# Altium project TrackCommenderCar_ControlBlock.PrjPcb
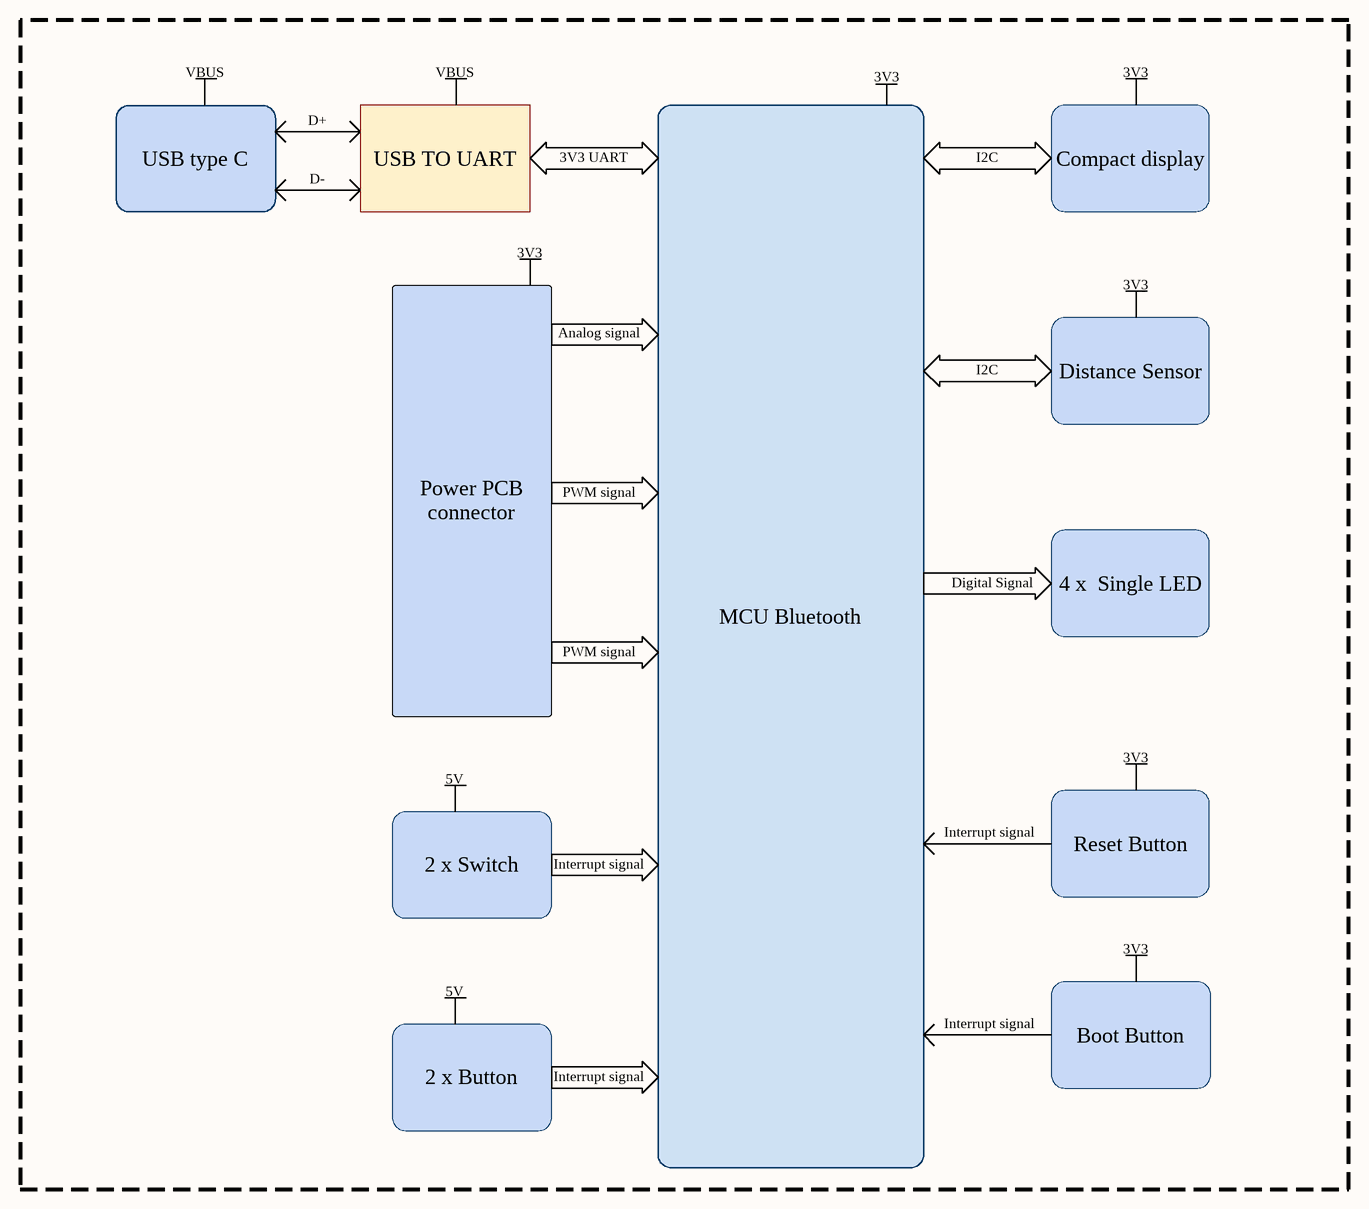
[diagram p0: OverView_TrackCommenderCar_FunctionPart.SchDoc]
3 sheets, 108 parts. Net scope: flat (ports and power ports of the same name join across sheets).
Board file: TrackCommanderCar.PcbDoc
Sheets:
  OverView_TrackCommenderCar_FunctionPart.SchDoc
  Sch_TrackCommanderCar_PowerPart.SchDoc
  Sch_TrackCommenderCar_FunctionPart.SchDoc

## Sheet OverView_TrackCommenderCar_FunctionPart.SchDoc
size 420 x 297 mm; SheetNumber: 1; SheetTotal: 2

### Notes on the sheet
- VBUS
- 3V3
- D+
- USB type C
- D-
- USB TO UART
- 3V3 UART
- I2C
- Compact display
- Analog signal
- Distance Sensor
- Power PCB connector
- PWM signal
- Digital Signal
- 4 x  Single LED
- MCU Bluetooth
- 5V
- 2 x Switch
- Interrupt signal
- Reset Button
- 2 x Button
- Boot Button

## Sheet Sch_TrackCommanderCar_PowerPart.SchDoc
size 457 x 254 mm; SheetNumber: 2; SheetTotal: 3
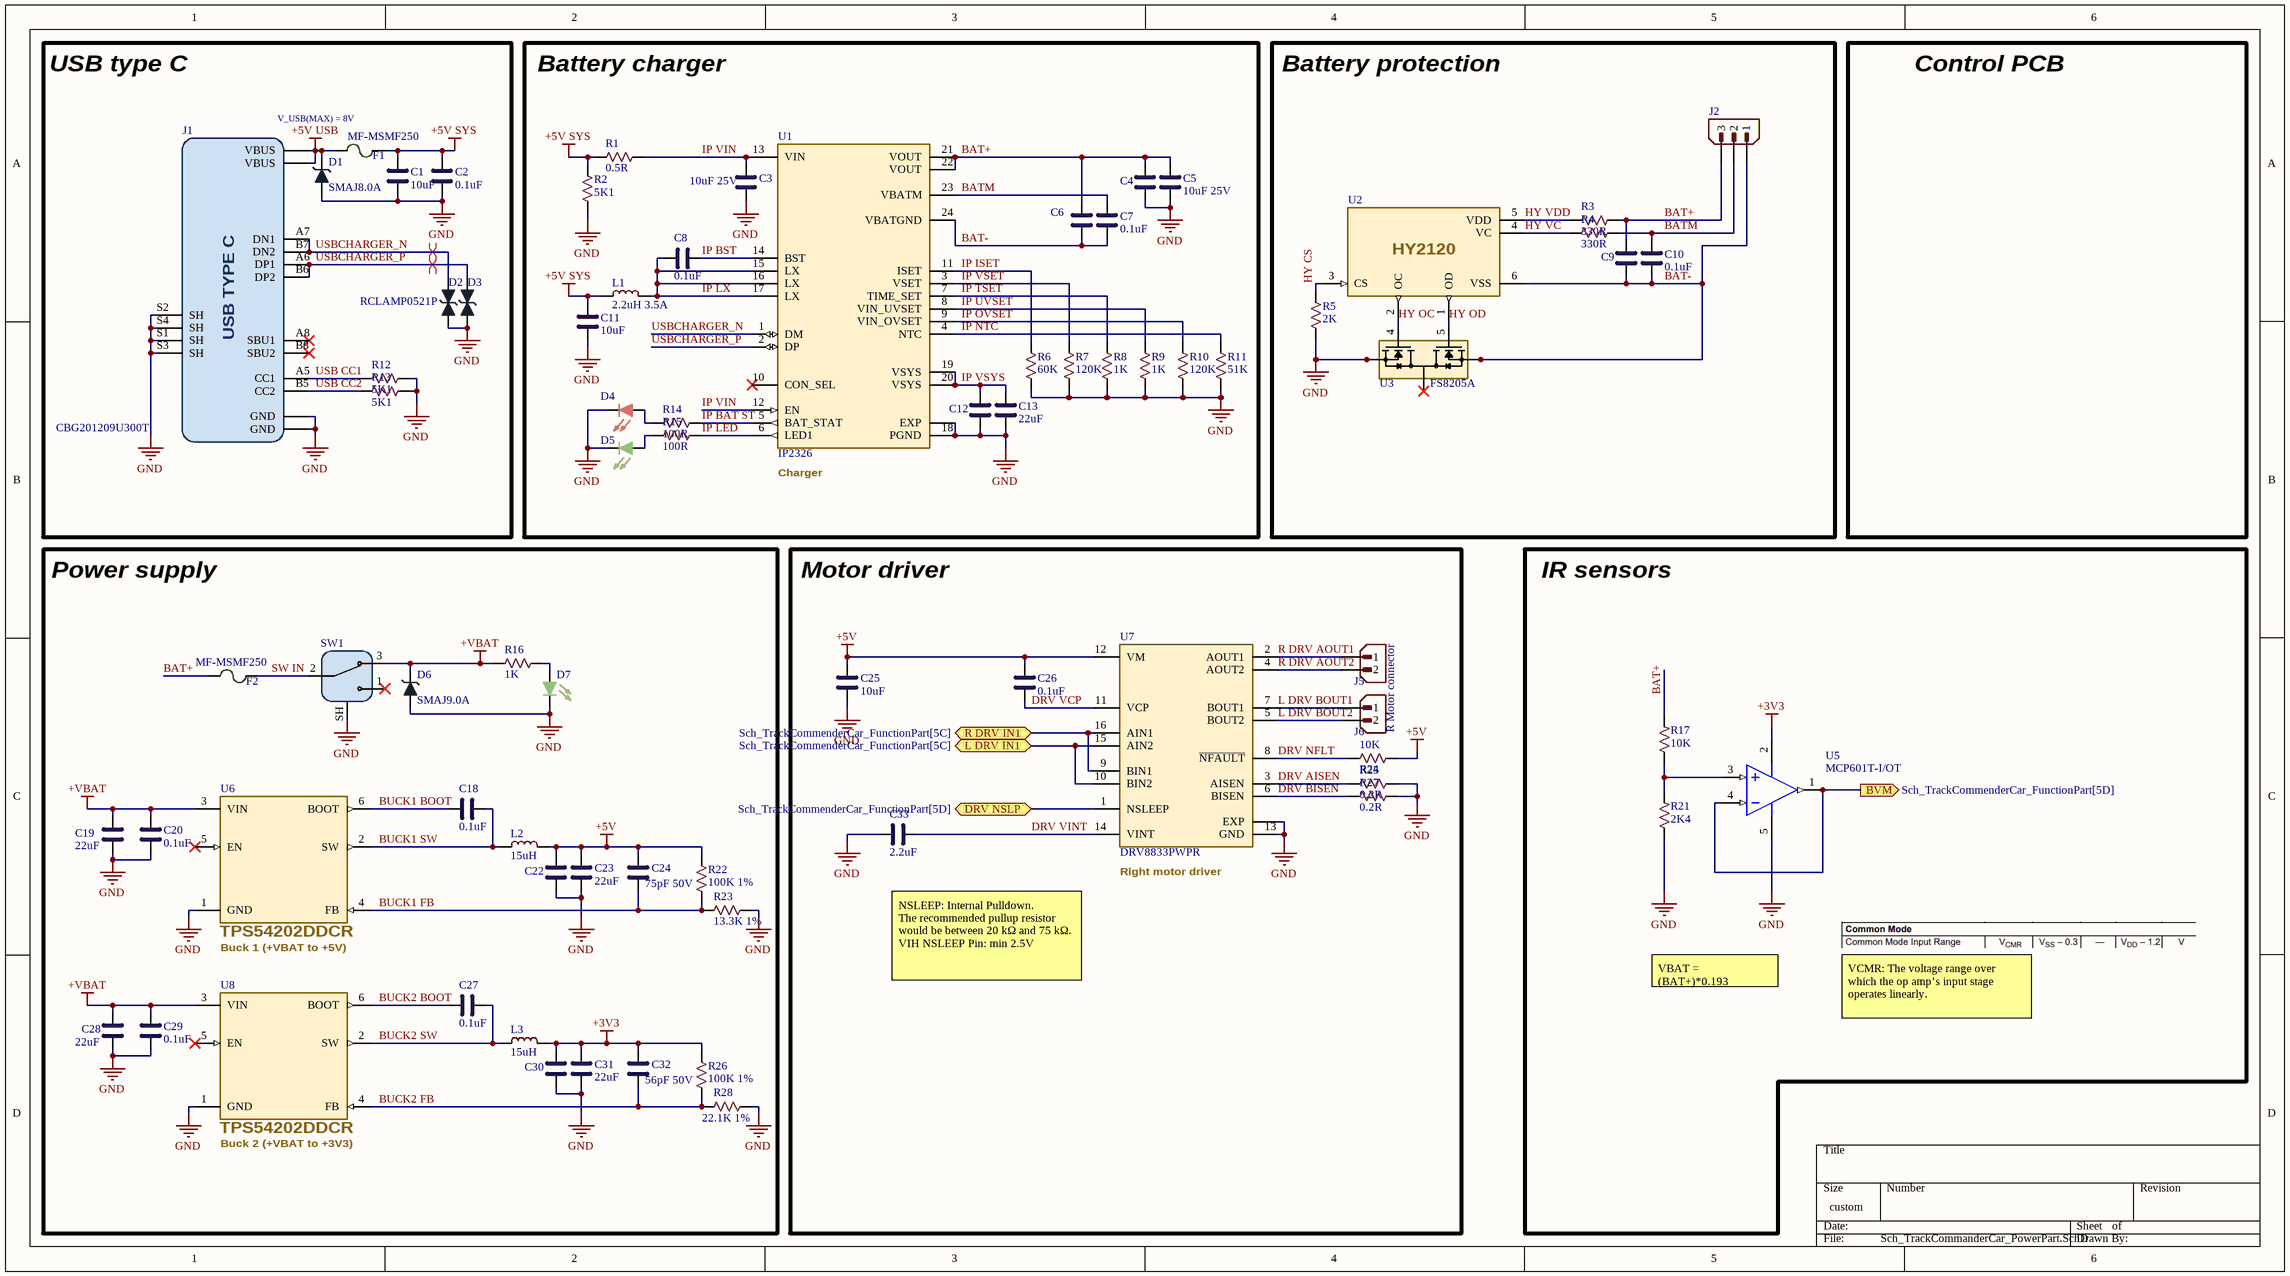
[diagram p1: Sch_TrackCommanderCar_PowerPart.SchDoc]

### Parts
10K  R24  [R_0402]
C1  10uF  [C_0603]
C2  0.1uF  [C_0402]
C3  10uF 25V  [C_0603]
C4  10uF 25V  [C_0603]  (value not drawn)
C5  10uF 25V  [C_0603]
C6  0.1uF  [C_0402]  (value not drawn)
C7  0.1uF  [C_0402]
C8  0.1uF  [C_0402]
C9  0.1uF  [C_0402]  (value not drawn)
C10  0.1uF  [C_0402]
C11  10uF  [C_0603]
C12  22uF  [C_0603]  (value not drawn)
C13  22uF  [C_0603]
C18  0.1uF  [C_0402]
C19  22uF  [C_0603]
C20  0.1uF  [C_0402]
C22  22uF  [C_0603]  (value not drawn)
C23  22uF  [C_0603]
C24  75pF 50V  [C_0603]
C25  10uF  [C_0603]
C26  0.1uF  [C_0402]
C27  0.1uF  [C_0402]
C28  22uF  [C_0603]
C29  0.1uF  [C_0402]
C30  22uF  [C_0603]  (value not drawn)
C31  22uF  [C_0603]
C32  56pF 50V  [C_0603]
C33  2.2uF  [C_0603]
D1  SMAJ8.0A  [TVS_SMAJ_XA]
D2  RCLAMP0521P  [TVS_RCLAMP0521P]  (value not drawn)
D3  RCLAMP0521P  [TVS_RCLAMP0521P]
D4  Led_Red  [Led_0603]  (value not drawn)
D5  Led_Green  [Led_0603]  (value not drawn)
D6  SMAJ9.0A  [TVS_SMAJ_XA]
D7  Led_Green  [Led_0603]  (value not drawn)
F1  MF-MSMF250  [Fuse1812]
F2  MF-MSMF250  [Fuse1812]
J1  USB TYPE C  [USB_C_16Pin]
J2  JST XH_3_2.5  [JST XH_3_2.5]  (value not drawn)
J5  R Motor connector  [JST PH_2_2.0]  (value not drawn)
J6  R Motor connector  [JST PH_2_2.0]
L1  2.2uH 3.5A  [Inductor 2.2uH 3.5A]
L2  15uH  [Inductor SMD 15uH 1.1A]
L3  15uH  [Inductor SMD 15uH 1.1A]
R1  0.5R  [R_0402]
R2  5K1  [R_0402]
R3  330R  [R_0402]
R4  330R  [R_0402]
R5  2K  [R_0805]
R6  60K  [R_0402]
R7  120K  [R_0402]
R8  1K  [R_0402]
R9  1K  [R_0402]
R10  120K  [R_0402]
R11  51K  [R_0402]
R12  5K1  [R_0402]
R13  5K1  [R_0402]
R14  100R  [R_0402]
R15  100R  [R_0402]
R16  1K  [R_0402]
R17  10K  [R_0402]
R21  2K4  [R_0402]
R22  100K 1%  [R_0402]
R23  13.3K 1%  [R_0402]
R25  0.2R  [R_0402]
R26  100K 1%  [R_0402]
R27  0.2R  [R_0402]
R28  22.1K 1%  [R_0402]
SW1  SSW  [Slide_SW_SS12F23G4]  (value not drawn)
U1  IP2326  [IP2326_QFN_24]
U2  HY2120  [HY2120]
U3  FS8205A  [FS8205A]
U5  MCP601T-I/OT  [SOT23_OPAMP]
U6  TPS54202DDCR  [TPS54202DDCR]
U7  DRV8833PWPR  [UMH3N SOT363]
U8  TPS54202DDCR  [TPS54202DDCR]

### Blocks framed on the sheet
CBG201209U300T: C1 C2 D1-D3 F1 J1 R12 R13
Charger: C3-C8 C11-C13 D4 D5 L1 R1 R2 R6-R11 R14 R15 U1
Right motor driver: 10K C25 C26 C33 J5 J6 R25 R27 U7

### Ports
BVM (out, see Sch_TrackCommenderCar_FunctionPart[5D]), DRV NSLP (bidir, see Sch_TrackCommenderCar_FunctionPart[5D]), L DRV IN1 (bidir, see Sch_TrackCommenderCar_FunctionPart[5C]), R DRV IN1 (bidir, see Sch_TrackCommenderCar_FunctionPart[5C])

### Nets
+3V3: C30.2 C31.2 C32.2 L3.2 R26.2 U5.2(VSS)
+5V: 10K.2 C22.2 C23.2 C24.2 C25.2 C26.2 L2.2 R22.2 U7.12(VM)
+5V SYS: C1.2 C2.2 C11.2 F1.2 L1.1 R1.1 R2.2
+5V USB: D1.1(C) F1.1 J1.A4_B9(VBUS) J1.B4_A9(VBUS)
+VBAT: C19.2 C20.2 C28.2 C29.2 D6.1(C) R16.1 SW1.3 U6.3(VIN) U8.3(VIN)
GND: C1.1 C2.1 C3.1 C4.1 C5.1 C11.1 C12.1 C13.1 C19.1 C20.1 C22.1 C23.1 C25.1 C28.1 C29.1 C30.1 C31.1 C33.1 D1.2(A) D2.1 D3.1 D4.1(K) D5.1(K) D6.2(A) D7.1(K) J1.A1_B12(GND) J1.B1_A12(GND) J1.S1(SH) J1.S2(SH) J1.S3(SH) J1.S4(SH) R2.1 R5.1 R6.1 R7.1 R8.1 R9.1 R10.1 R11.1 R12.2 R13.2 R21.1 R23.1 R25.2 R27.2 R28.1 SW1.SH U1.18(PGND) U1.GND(EXP) U3.2(S1) U3.3(S1) U5.5(VDD) U6.1(GND) U7.13(GND) U7.GND(EXP) U8.1(GND)
BAT+: C4.2 C5.2 C6.2 C9.2 F2.1 J2.3 R3.2 R17.2 U1.21(VOUT) U1.22(VOUT)
BAT-: C6.1 C7.1 C9.1 C10.1 J2.1 U1.24(VBATGND) U2.6(VSS) U3.6(S2) U3.7(S2)
BATM: C7.2 C10.2 J2.2 R4.2 U1.23(VBATM)
BUCK1 BOOT: C18.2 U6.6(BOOT)
BUCK1 FB: C24.1 R22.1 R23.2 U6.4(FB)
BUCK1 SW: C18.1 L2.1 U6.2(SW)
BUCK2 BOOT: C27.1 U8.6(BOOT)
BUCK2 FB: C32.1 R26.1 R28.2 U8.4(FB)
BUCK2 SW: C27.2 L3.1 U8.2(SW)
BVM: U5.1(VOUT) U5.4(VIN-) ; port BVM
DRV AISEN: R25.1 U7.3(AISEN)
DRV BISEN: R27.1 U7.6(BISEN)
DRV NFLT: 10K.1 U7.8(~{NFAULT})
DRV NSLP: U7.1(NSLEEP) ; port DRV NSLP
DRV VCP: C26.1 U7.11(VCP)
DRV VINT: C33.2 U7.14(VINT)
HY CS: R5.2 U2.3(CS)
HY OC: U2.2(OC) U3.4(G1)
HY OD: U2.1(OD) U3.5(G2)
HY VC: R4.1 U2.4(VC)
HY VDD: R3.1 U2.5(VDD)
IP BAT ST: R14.2 U1.5(BAT_STAT)
IP BST: C8.1 U1.14(BST)
IP ISET: R6.2 U1.11(ISET)
IP LED: R15.2 U1.6(LED1)
IP LX: C8.2 L1.2 U1.15(LX) U1.16(LX) U1.17(LX)
IP NTC: R11.2 U1.4(NTC)
IP OVSET: R10.2 U1.9(VIN_OVSET)
IP TSET: R8.2 U1.7(TIME_SET)
IP UVSET: R9.2 U1.8(VIN_UVSET)
IP VIN: C3.2 R1.2 U1.12(EN) U1.13(VIN)
IP VSET: R7.2 U1.3(VSET)
IP VSYS: C12.2 C13.2 U1.19(VSYS) U1.20(VSYS)
L DRV BOUT1: J6.1 U7.7(BOUT1)
L DRV BOUT2: J6.2 U7.5(BOUT2)
L DRV IN1: U7.10(BIN2) U7.15(AIN2) ; port L DRV IN1
R DRV AOUT1: J5.1 U7.2(AOUT1)
R DRV AOUT2: J5.2 U7.4(AOUT2)
R DRV IN1: U7.9(BIN1) U7.16(AIN1) ; port R DRV IN1
SW IN: F2.2 SW1.2
USB CC1: J1.A5(CC1) R12.1
USB CC2: J1.B5(CC2) R13.1
USBCHARGER_N: D2.2 J1.A7(DN1) J1.B7(DN2) U1.1(DM)
USBCHARGER_P: D3.2 J1.A6(DP1) J1.B6(DP2) U1.2(DP)
NetD4_2: D4.2(A) R14.1
NetD5_2: D5.2(A) R15.1
NetD7_2: D7.2(A) R16.2
NetR17_1: R17.1 R21.2 U5.3(VIN+)
NetU3_1: U3.1(D12) U3.8(D12)

Not connected (* = marked no-connect by the designer): J1 A8(SBU1)* B8(SBU2)*; SW1 1*; U1 10(CON_SEL)*; U6 5(EN)*; U8 5(EN)*

### Layout directives
differential pair: USBCHARGER_N, USBCHARGER_P

### Notes on the sheet
- USB type C
- Battery charger
- Battery protection
- Control PCB connector
- V_USB(MAX) = 8V
- Power supply
- Motor driver
- IR sensors
- Buck 1 (+VBAT to +5V)
- NSLEEP: Internal Pulldown.
  The recommended pullup resistor would be between 20 kΩ and 75 kΩ.
  VIH NSLEEP Pin: min 2.5V
- VBAT = (BAT+)*0.193
- VCMR: The voltage range over which the op amp’s input stage operates linearly.
- (near U8) Buck 2 (+VBAT to +3V3)

### Library data of the parts
10K R1-R4 R6-R17 R21-R23 R25-R28 = R0402
C1 C3-C5 C11-C13 C19 C22-C25 C28 C30-C33 = C0603
C2 C6-C10 C18 C20 C26 C27 C29 = C0402
D1 D6 = TVS_SMAJ_XA
D2 D3 = TVS_RCLAMP0521P
F1 F2 = Fuse1812
J1 = USB_C: 16_PIN
J5 J6 = JST PH_2_2.0
L1 = Inductor 2.2uH 3.5A
L2 L3 = Inductor 15uH 1.1A: 15uH 1.1A, size 5.7x5.7x3.2 mm
R5 = R0805
U2 = HY2120: Battery protection
U3 = FS8205A: Back to back MOSFET
U5 = MCP601T-I/OT: Op Amp Single Low Power Amplifier R-R O/P 6V Automotive 5-Pin SOT-23 T/R; Manufacturer: Microchip; Bandwidth: 2.8MHz; Common Mode Rejection Ratio: 75dB; Input Bias Current: 60pA; Input Offset Voltage (Vos): 2mV; Max Output Current: 30mA; Max Supply Current: 2mA; Min Supply Voltage: 2.7V; Nominal Supply Current: 230µA; Number of Amplifiers: 1; Operating Supply Voltage: 5.5V; Output Current: 22mA; Power Supply Rejection Ratio (PSRR): 80dB; Settling Time: 4.5µs; Slew Rate: 2.3V/µs; Voltage: 5V; Voltage Gain: 115dB; Supplier 1: Arrow Electronics; Manufacturer Part Number: MCP601T-I/OT; RoHS: Compliant; Category: Amplifiers - Op Amps, Buffer, Instrumentation; Stock 1: 12000; Pricing 1: 3000=0.4064 (USD); Projected EOL Date: 2034-01-01; Case/Package: SOT-23; Country of Assembly: Malaysia, Thailand; Country of Fabrication: United States of America; Country of Origin: Malaysia, Thailand; Export Control Classification Number (ECCN) Code: EAR99; Gain Bandwidth Product: 2.8MHz; Height: 1.3mm; Harmonized Tariff Schedule (HTS) Code: 8542.33.0001; Introduction Date: 2002-01-01; Lead Free: Lead Free; Length: 3.1mm; Lifecycle Status: Production; Max Operating Temperature: 85°C; Max Supply Voltage: 6V; Min Operating Temperature: -40°C; Mount: Surface Mount; Number of Channels: 1; Number of Circuits: 1; Number of Elements: 1; Number of Pins: 5; Packaging: Cut Tape; Radiation Hardening: No; REACH SVHC: No; Schedule B: 8542330000, 8542330000|8542330000|8542330000|8542330000|8542330000; Width: 1.8mm; ComponentLink1URL: https://datasheet.octopart.com:443/MCP601T-I/OT-Microchip-datasheet-8327811.pdf?src-supplier=Augswan; ComponentLink1Description: https://datasheet.octopart.com:443/MCP601T-I/OT-Microchip-datasheet-8327811.pdf?src-supplier=Augswan; ComponentLink2URL: https://datasheet.octopart.com:443/MCP601T-I/OT-Microchip-datasheet-7869.pdf?src-supplier=element14; ComponentLink2Description: https://datasheet.octopart.com:443/MCP601T-I/OT-Microchip-datasheet-7869.pdf?src-supplier=element14; ComponentLink3URL: https://datasheet.octopart.com:443/MCP601T-I-OT-Microchip-datasheet-170283493.pdf?src-supplier=Microchip; ComponentLink3Description: https://datasheet.octopart.com:443/MCP601T-I-OT-Microchip-datasheet-170283493.pdf?src-supplier=Microchip; ComponentLink4URL: https://datasheet.octopart.com:443/MCP601T-I-OT-Microchip-datasheet-158592061.pdf?src-supplier=SHENGYU+ELECTRONICS; ComponentLink4Description: https://datasheet.octopart.com:443/MCP601T-I-OT-Microchip-datasheet-158592061.pdf?src-supplier=SHENGYU+ELECTRONICS; ComponentLink5URL: https://datasheet.octopart.com:443/MCP601T-I/OT-Microchip-datasheet-9917688.pdf?src-supplier=RS+(Formerly+Allied+Electronics); ComponentLink5Description: https://datasheet.octopart.com:443/MCP601T-I/OT-Microchip-datasheet-9917688.pdf?src-supplier=RS+(Formerly+Allied+Electronics); ComponentLink6URL: https://datasheet.octopart.com:443/MCP601T-I-OT-Microchip-datasheet-140568181.pdf?src-supplier=Arrow.cn; ComponentLink6Description: https://datasheet.octopart.com:443/MCP601T-I-OT-Microchip-datasheet-140568181.pdf?src-supplier=Arrow.cn; ComponentLink7URL: http://sigma.octopart.com:80/188449423/materials_sheet/Microchip-MCP601T-I-OT.pdf?src-supplier=Compliance+Statements; ComponentLink7Description: http://sigma.octopart.com:80/188449423/materials_sheet/Microchip-MCP601T-I-OT.pdf?src-supplier=Compliance+Statements; ComponentLink8URL: http://sigma.octopart.com:80/conflict_mineral_statement/Microchip-company-68.pdf?src-supplier=Compliance+Statements; ComponentLink8Description: http://sigma.octopart.com:80/conflict_mineral_statement/Microchip-company-68.pdf?src-supplier=Compliance+Statements; ComponentLink9URL: http://sigma.octopart.com:80/conflict_mineral_statement/Microchip-company-69.pdf?src-supplier=Compliance+Statements; ComponentLink9Description: http://sigma.octopart.com:80/conflict_mineral_statement/Microchip-company-69.pdf?src-supplier=Compliance+Statements; ComponentLink10URL: http://sigma.octopart.com:80/reach_statement/Microchip-company-70.pdf?src-supplier=Compliance+Statements; ComponentLink10Description: http://sigma.octopart.com:80/reach_statement/Microchip-company-70.pdf?src-supplier=Compliance+Statements; ComponentLink11URL: http://sigma.octopart.com:80/rohs_statement/Microchip-company-71.pdf?src-supplier=Compliance+Statements; ComponentLink11Description: http://sigma.octopart.com:80/rohs_statement/Microchip-company-71.pdf?src-supplier=Compliance+Statements; Supplier Part Number 1: MCP601T-I/OT
U7 = DRV8833PWPR: Dual H-Bridge Motor Driver

## Sheet Sch_TrackCommenderCar_FunctionPart.SchDoc
size 381 x 241 mm; SheetNumber: 3; SheetTotal: 3
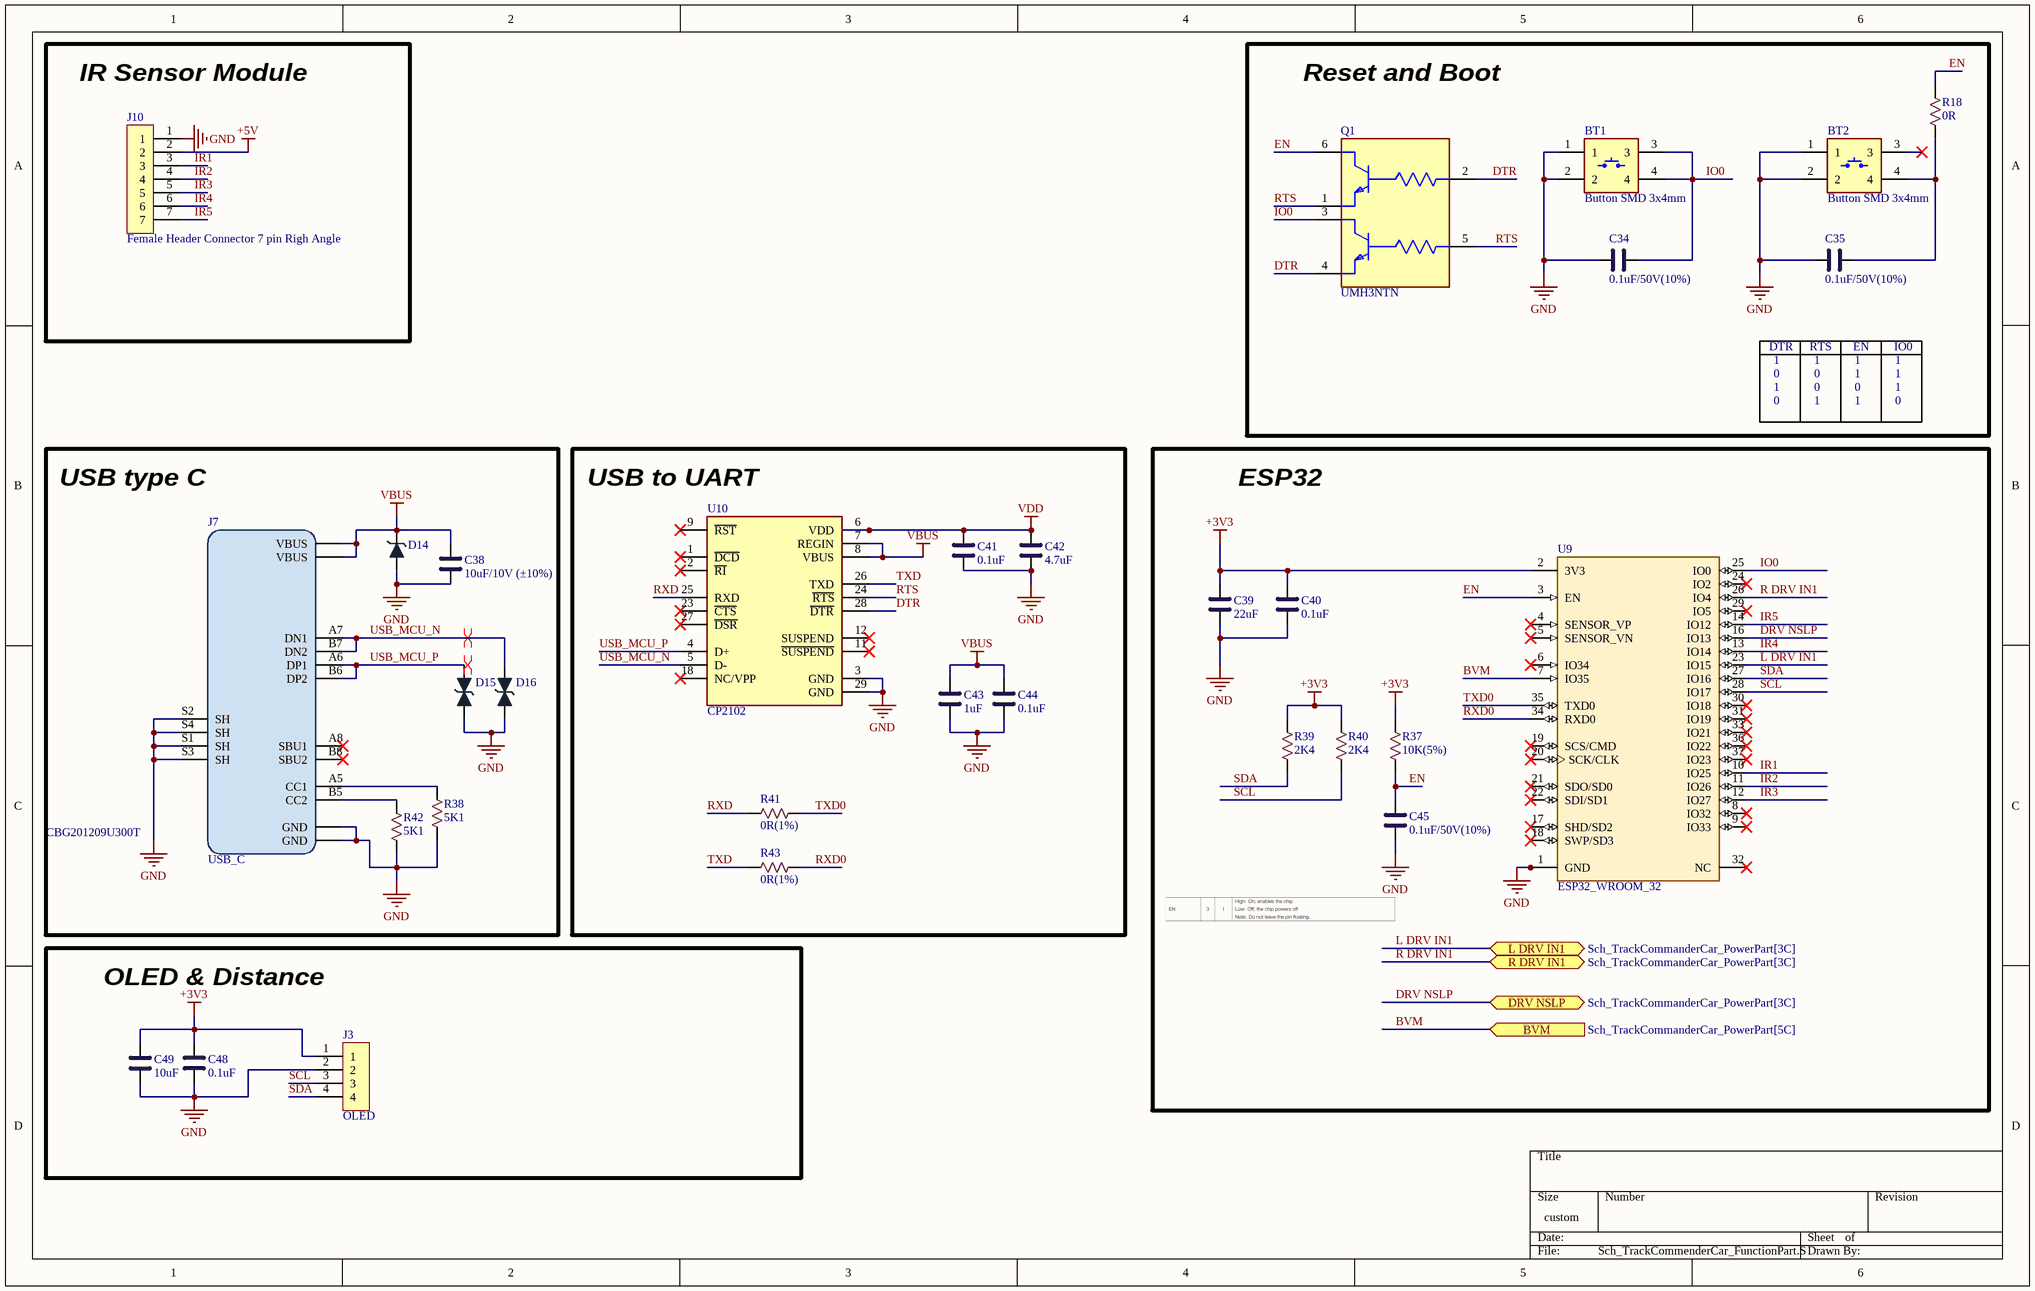
[diagram p2: Sch_TrackCommenderCar_FunctionPart.SchDoc]

### Parts
BT1  Button SMD 3x4mm  [Button SMD 3x4mm]
BT2  Button SMD 3x4mm  [Button SMD 3x4mm]
C34  0.1uF/50V(10%)  [C_0402]
C35  0.1uF/50V(10%)  [C_0402]
C38  10uF/10V (±10%)  [C_0603]
C39  22uF  [C_0603]
C40  0.1uF  [C_0402]
C41  0.1uF  [C_0402]
C42  4.7uF  [C_0603]
C43  1uF  [C_0603]
C44  0.1uF  [C_0402]
C45  0.1uF/50V(10%)  [C_0402]
C48  0.1uF  [C_0402]
C49  10uF  [C_0603]
D14  TVS_SMAJ_XA  [TVS_SMAJ_XA]  (value not drawn)
D15  TVS_RCLAMP0521P  [TVS_RCLAMP0521P]  (value not drawn)
D16  TVS_RCLAMP0521P  [TVS_RCLAMP0521P]  (value not drawn)
J3  OLED  [Header Female 1x4 2.54mm]
J7  USB_C  [USB_C_16Pin]
J10  Female Header Connector 7 pin Righ Angle  [7 Position Receptacle Connector 0.100" (2.54mm) Through Hole, Right Angle]
Q1  UMH3NTN  [UMH3N SOT363]
R18  0R  [R_0402]
R37  10K(5%)  [R_0402]
R38  5K1  [R_0402]
R39  2K4  [R_0402]
R40  2K4  [R_0402]
R41  0R(1%)  [R_0402]
R42  5K1  [R_0402]
R43  0R(1%)  [R_0402]
U9  ESP32_WROOM_32  [ESP32_Wroom_32]
U10  CP2102  [CP2102]

### Blocks framed on the sheet
CBG201209U300T: C38 D14-D16 J7 R38 R42

### Ports
BVM (in, see Sch_TrackCommanderCar_PowerPart[5C]), DRV NSLP (bidir, see Sch_TrackCommanderCar_PowerPart[3C]), L DRV IN1 (bidir, see Sch_TrackCommanderCar_PowerPart[3C]), R DRV IN1 (bidir, see Sch_TrackCommanderCar_PowerPart[3C])

### Nets
+3V3: C39.2 C40.2 C48.2 C49.2 J3.1 R37.2 R39.2 R40.2 U9.2(3V3)
+5V: J10.2
GND: BT1.1 BT1.2 BT2.1 BT2.2 C34.1 C35.1 C38.1 C39.1 C40.1 C41.1 C42.1 C43.1 C44.1 C45.1 C48.1 C49.1 D14.2(A) D15.1 D16.1 J3.2 J7.A1_B12(GND) J7.B1_A12(GND) J7.S1(SH) J7.S2(SH) J7.S3(SH) J7.S4(SH) J10.1 R38.1 R42.1 U9.1(GND) U9.15(GND) U9.38(GND) U9.GND U10.3(GND) U10.29(GND)
VBUS: C38.2 C43.2 C44.2 D14.1(C) J7.A4_B9(VBUS) J7.B4_A9(VBUS) U10.7(REGIN) U10.8(VBUS)
VDD: C41.2 C42.2 U10.6(VDD)
BVM: U9.7(IO35) ; port BVM
DRV NSLP: U9.16(IO13) ; port DRV NSLP
DTR: Q1.2(B) Q1.4(E) U10.28(~{DTR})
EN: C45.2 Q1.6(C) R18.2 R37.1 U9.3(EN)
IO0: BT1.3 BT1.4 C34.2 Q1.3(C) U9.25(IO0)
IR1: J10.3 U9.10(IO25)
IR2: J10.4 U9.11(IO26)
IR3: J10.5 U9.12(IO27)
IR4: J10.6 U9.13(IO14)
IR5: J10.7 U9.14(IO12)
L DRV IN1: U9.23(IO15) ; port L DRV IN1
R DRV IN1: U9.26(IO4) ; port R DRV IN1
RTS: Q1.1(E) Q1.5(B) U10.24(~{RTS})
RXD: R41.1 U10.25(RXD)
RXD0: R43.2 U9.34(RXD0)
SCL: J3.3 R40.1 U9.28(IO17)
SDA: J3.4 R39.1 U9.27(IO16)
TXD: R43.1 U10.26(TXD)
TXD0: R41.2 U9.35(TXD0)
USB_MCU_N: D16.2 J7.A7(DN1) J7.B7(DN2) U10.5(D-)
USB_MCU_P: D15.2 J7.A6(DP1) J7.B6(DP2) U10.4(D+)
NetBT2_4: BT2.4 C35.2 R18.1
NetJ7_A5: J7.A5(CC1) R38.2
NetJ7_B5: J7.B5(CC2) R42.2

Not connected (* = marked no-connect by the designer): BT2 3*; J7 A8(SBU1)* B8(SBU2)*; U9 4(SENSOR_VP)* 5(SENSOR_VN)* 6(IO34)* 8(IO32)* 9(IO33)* 17(SHD/SD2)* 18(SWP/SD3)* 19(SCS/CMD)* 20(SCK/CLK)* 21(SDO/SD0)* 22(SDI/SD1)* 24(IO2)* 29(IO5)* 30(IO18)* 31(IO19)* 32(NC)* 33(IO21)* 36(IO22)* 37(IO23)*; U10 1(~{DCD})* 2(~{RI})* 9(~{RST})* 11(~{SUSPEND})* 12(SUSPEND)* 18(NC/VPP)* 23(~{CTS})* 27(~{DSR})*

### Layout directives
differential pair: USB_MCU_N, USB_MCU_P

### Notes on the sheet
- IR Sensor Module
- Reset and Boot button
- DTR
- 1
- RTS
- EN
- IO0
- 0
- USB type C
- (near U10) USB to UART
- ESP32 WROOM32
- OLED & Distance Sensor

### Library data of the parts
C34 C35 C40 C41 C44 C45 C48 = C0402
C38 C39 C42 C43 C49 = C0603
J3 = Header Female 1x4 2.54mm
J7 = USB_C: 16_PIN
Q1 = UMH3NTN: Small Signal Bipolar Transistor, 0.1A I(C), 50V V(BR)CEO, 2-Element, NPN, Silicon; Manufacturer: ROHM; Collector Emitter Saturation Voltage: 300mV; Continuous Collector Current: 100mA; Element Configuration: Dual; Emitter Base Voltage (VEBO): 5V; hFE Min: 100; Max Junction Temperature (Tj): 150°C; Max Power Dissipation: 150mW; Number of Elements: 2; Transition Frequency: 250MHz; Supplier 1: DigiKey; Manufacturer Part Number: UMH3NTN; RoHS: Compliant; Category: BJTs; Stock 1: 7536; Pricing 1: 1=0.47, 10=0.29, 100=0.1836, 500=0.1375, 1000=0.12259 (USD); Case/Package: SOT-363; Collector Base Voltage (VCBO): 50V; Collector Emitter Breakdown Voltage: 50V; Collector Emitter Voltage (VCEO): 50V; Current Rating: 100mA; Height: 1mm; Lead Free: Lead Free; Lifecycle Status: Production; Max Breakdown Voltage: 50V; Max Collector Current: 100mA; Max Operating Temperature: 150°C; Max Output Current: 100mA; Min Operating Temperature: -55°C; Mount: Surface Mount; Number of Pins: 6; Number of Terminals: 6; Operating Supply Voltage: 50V; Polarity: NPN; Power Dissipation: 150mW; Radiation Hardening: No; REACH SVHC: Yes; Schedule B: 8541210080|8541210080|8541210080|8541210080|8541210080; Voltage Rating (DC): 50V; ComponentLink1URL: https://datasheet.octopart.com:443/UMH3NTN-ROHM-datasheet-181221233.pdf?src-supplier=Farnell; ComponentLink1Description: https://datasheet.octopart.com:443/UMH3NTN-ROHM-datasheet-181221233.pdf?src-supplier=Farnell; ComponentLink2URL: https://datasheet.octopart.com:443/UMH3NTN-Rohm-datasheet-82997545.pdf?src-supplier=Farnell; ComponentLink2Description: https://datasheet.octopart.com:443/UMH3NTN-Rohm-datasheet-82997545.pdf?src-supplier=Farnell; ComponentLink3URL: https://sigma.octopart.com:443/154577397/technical_drawing/ROHM-UMH3NTN.pdf?src-supplier=Upverter; ComponentLink3Description: https://sigma.octopart.com:443/154577397/technical_drawing/ROHM-UMH3NTN.pdf?src-supplier=Upverter; ComponentLink4URL: https://datasheet.octopart.com:443/UMH3NTN-Rohm-datasheet-548145.pdf?src-supplier=Newark; ComponentLink4Description: https://datasheet.octopart.com:443/UMH3NTN-Rohm-datasheet-548145.pdf?src-supplier=Newark; ComponentLink5URL: https://datasheet.octopart.com:443/UMH3NTN-Rohm-datasheet-41569966.pdf?src-supplier=Newark; ComponentLink5Description: https://datasheet.octopart.com:443/UMH3NTN-Rohm-datasheet-41569966.pdf?src-supplier=Newark; ComponentLink6URL: https://datasheet.octopart.com:443/UMH3NTN-Rohm-datasheet-142144791.pdf?src-supplier=Rohm+SCT; ComponentLink6Description: https://datasheet.octopart.com:443/UMH3NTN-Rohm-datasheet-142144791.pdf?src-supplier=Rohm+SCT; ComponentLink7URL: https://datasheet.octopart.com:443/UMH3NTN-Rohm-datasheet-61695679.pdf?src-supplier=Future+Electronics; ComponentLink7Description: https://datasheet.octopart.com:443/UMH3NTN-Rohm-datasheet-61695679.pdf?src-supplier=Future+Electronics; ComponentLink8URL: https://datasheet.octopart.com:443/UMH3NTN-Rohm-datasheet-21405252.pdf?src-supplier=element14+APAC; ComponentLink8Description: https://datasheet.octopart.com:443/UMH3NTN-Rohm-datasheet-21405252.pdf?src-supplier=element14+APAC; ComponentLink9URL: https://datasheet.octopart.com:443/UMH3NTN-Rohm-datasheet-31182.pdf?src-supplier=DigiKey; ComponentLink9Description: https://datasheet.octopart.com:443/UMH3NTN-Rohm-datasheet-31182.pdf?src-supplier=DigiKey; ComponentLink10URL: https://datasheet.octopart.com:443/UMH3NTN-Rohm-datasheet-14064263.pdf?src-supplier=iiiC; ComponentLink10Description: https://datasheet.octopart.com:443/UMH3NTN-Rohm-datasheet-14064263.pdf?src-supplier=iiiC; Supplier Part Number 1: UMH3NTNCT-ND
R18 R37-R43 = R0402

## Nets that join several sheets
+3V3: Sch_TrackCommanderCar_PowerPart (6 pins), Sch_TrackCommenderCar_FunctionPart (9 pins)
+5V: Sch_TrackCommanderCar_PowerPart (9 pins), Sch_TrackCommenderCar_FunctionPart (J10.2)
GND: Sch_TrackCommanderCar_PowerPart (56 pins), Sch_TrackCommenderCar_FunctionPart (35 pins)
BVM: Sch_TrackCommanderCar_PowerPart (U5.1 U5.4), Sch_TrackCommenderCar_FunctionPart (U9.7)
DRV NSLP: Sch_TrackCommanderCar_PowerPart (U7.1), Sch_TrackCommenderCar_FunctionPart (U9.16)
L DRV IN1: Sch_TrackCommanderCar_PowerPart (U7.10 U7.15), Sch_TrackCommenderCar_FunctionPart (U9.23)
R DRV IN1: Sch_TrackCommanderCar_PowerPart (U7.9 U7.16), Sch_TrackCommenderCar_FunctionPart (U9.26)